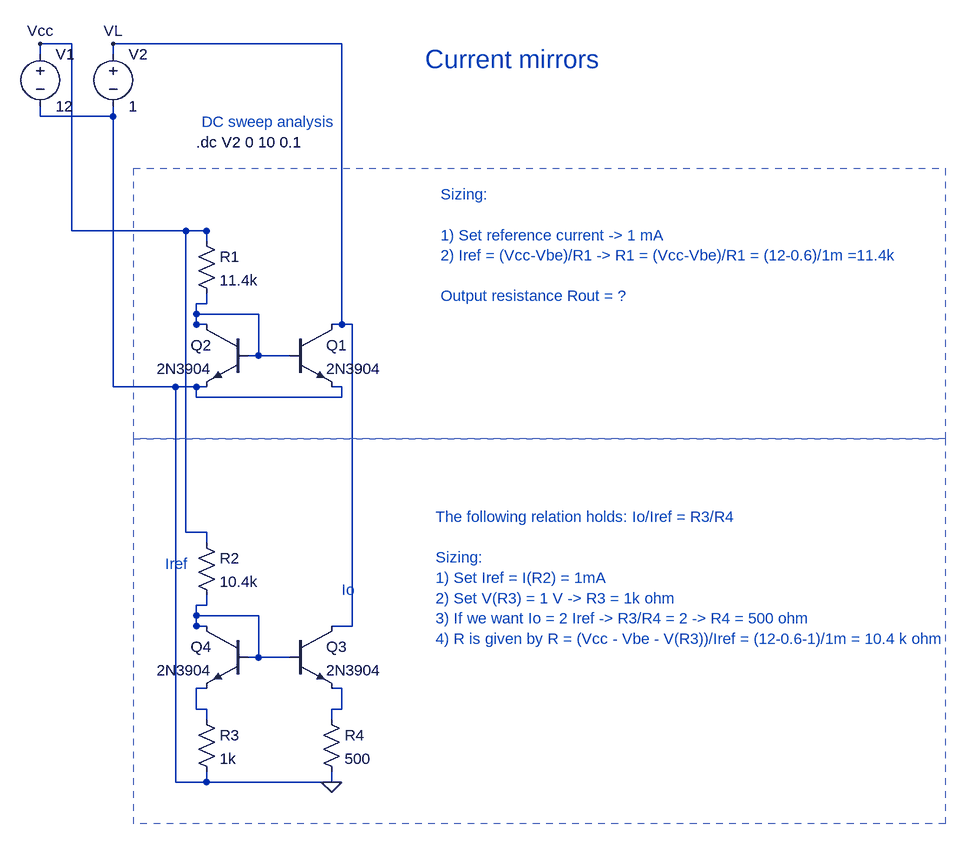
[diagram p0: schematic Current-mirrors.asc]
Current-mirrors.asc, the LTspice schematic file:
Version 4.1
SHEET 1 1348 1060
WIRE 304 384 320 384
WIRE 112 384 96 384
WIRE 112 976 112 992
WIRE 304 976 304 992
WIRE -144 -48 -144 -32
WIRE -32 -48 -32 -32
WIRE 320 384 320 400
WIRE 320 400 96 400
WIRE 96 400 96 384
WIRE 96 384 -32 384
WIRE -32 384 -32 -32
WIRE -32 -32 -144 -32
WIRE 96 384 64 384
WIRE 64 384 64 992
WIRE 64 992 112 992
WIRE 112 992 304 992
FLAG 304 992 0
WIRE 240 336 224 336
WIRE 112 288 96 288
WIRE 176 336 192 336
WIRE 112 240 112 256
WIRE 224 336 192 336
WIRE 192 336 192 272
WIRE 192 272 96 272
WIRE 96 272 96 288
WIRE 96 288 96 256
WIRE 96 256 112 256
WIRE 240 800 224 800
WIRE 112 752 96 752
WIRE 176 800 192 800
WIRE 112 704 112 720
WIRE 224 800 192 800
WIRE 192 800 192 736
WIRE 192 736 96 736
WIRE 96 736 96 752
WIRE 96 752 96 720
WIRE 96 720 112 720
WIRE 112 848 96 848
WIRE 112 896 112 880
WIRE 96 848 96 880
WIRE 96 880 112 880
WIRE 304 848 320 848
WIRE 304 896 304 880
WIRE 320 848 320 880
WIRE 320 880 304 880
WIRE 304 288 320 288
WIRE 304 752 320 752
WIRE -32 -128 -32 -144
WIRE 320 288 336 288
WIRE 336 288 336 752
WIRE 336 752 320 752
WIRE 320 288 320 -144
WIRE 320 -144 -32 -144
FLAG -32 -144 VL
WIRE 112 160 112 144
WIRE 112 624 112 608
WIRE -144 -128 -144 -144
WIRE 112 144 80 144
WIRE 80 144 80 608
WIRE 80 608 112 608
WIRE 112 144 -96 144
WIRE -96 144 -96 -144
WIRE -96 -144 -144 -144
FLAG -144 -144 Vcc
SYMBOL voltage -144 -144 R0
WINDOW 123 0 0 Left 0
WINDOW 39 0 0 Left 0
SYMATTR InstName V1
SYMATTR Value 12
SYMBOL voltage -32 -144 R0
WINDOW 123 0 0 Left 0
WINDOW 39 0 0 Left 0
SYMATTR InstName V2
SYMATTR Value 1
SYMBOL npn 240 288 R0
SYMATTR InstName Q1
SYMATTR Value 2N3904
SYMBOL npn 176 288 M0
SYMATTR InstName Q2
SYMATTR Value 2N3904
SYMBOL res 96 144 R0
SYMATTR InstName R1
SYMATTR Value 11.4k
SYMBOL npn 240 752 R0
SYMATTR InstName Q3
SYMATTR Value 2N3904
SYMBOL npn 176 752 M0
SYMATTR InstName Q4
SYMATTR Value 2N3904
SYMBOL res 96 608 R0
SYMATTR InstName R2
SYMATTR Value 10.4k
SYMBOL res 96 880 R0
SYMATTR InstName R3
SYMATTR Value 1k
SYMBOL res 288 880 R0
SYMATTR InstName R4
SYMATTR Value 500
TEXT 96 8 Left 2 !.dc V2 0 10 0.1
TEXT 472 88 Left 2 ;Sizing:\n \n1) Set reference current -> 1 mA\n2) Iref = (Vcc-Vbe)/R1 -> R1 = (Vcc-Vbe)/R1 = (12-0.6)/1m =11.4k\n \nOutput resistance Rout = ?
TEXT 464 584 Left 2 ;The following relation holds: Io/Iref = R3/R4\n \nSizing:\n1) Set Iref = I(R2) = 1mA\n2) Set V(R3) = 1 V -> R3 = 1k ohm\n3) If we want Io = 2 Iref -> R3/R4 = 2 -> R4 = 500 ohm\n4) R is given by R = (Vcc - Vbe - V(R3))/Iref = (12-0.6-1)/1m = 10.4 k ohm
TEXT 320 696 Left 2 ;Io
TEXT 48 656 Left 2 ;Iref
TEXT 448 -120 Left 4 ;Current mirrors
TEXT 104 -24 Left 2 ;DC sweep analysis
RECTANGLE Normal 1248 464 0 48 2
RECTANGLE Normal 1248 1056 0 464 2

The netlist it stands for:
* Current-mirrors.asc
V1 Vcc 0 12
V2 VL 0 1
Q1 VL N001 0 0 2N3904
Q2 N001 N001 0 0 2N3904
R1 Vcc N001 11.4k
Q3 VL N002 N004 0 2N3904
Q4 N002 N002 N003 0 2N3904
R2 Vcc N002 10.4k
R3 N003 0 1k
R4 N004 0 500
.model NPN NPN
.model PNP PNP
.lib standard.bjt
.dc V2 0 10 0.1
* Sizing:
* 1) Set reference current -> 1 mA
* 2) Iref = (Vcc-Vbe)/R1 -> R1 = (Vcc-Vbe)/R1 = (12-0.6)/1m =11.4k
* Output resistance Rout = ?
* The following relation holds: Io/Iref = R3/R4
* Sizing:
* 1) Set Iref = I(R2) = 1mA
* 2) Set V(R3) = 1 V -> R3 = 1k ohm
* 3) If we want Io = 2 Iref -> R3/R4 = 2 -> R4 = 500 ohm
* 4) R is given by R = (Vcc - Vbe - V(R3))/Iref = (12-0.6-1)/1m = 10.4 k ohm
* Io
* Iref
* Current mirrors
* DC sweep analysis
.backanno
.end